# EAGLE design RJ45_EURORACK_BRIDGE_castellated (EAGLE 9.6.2)
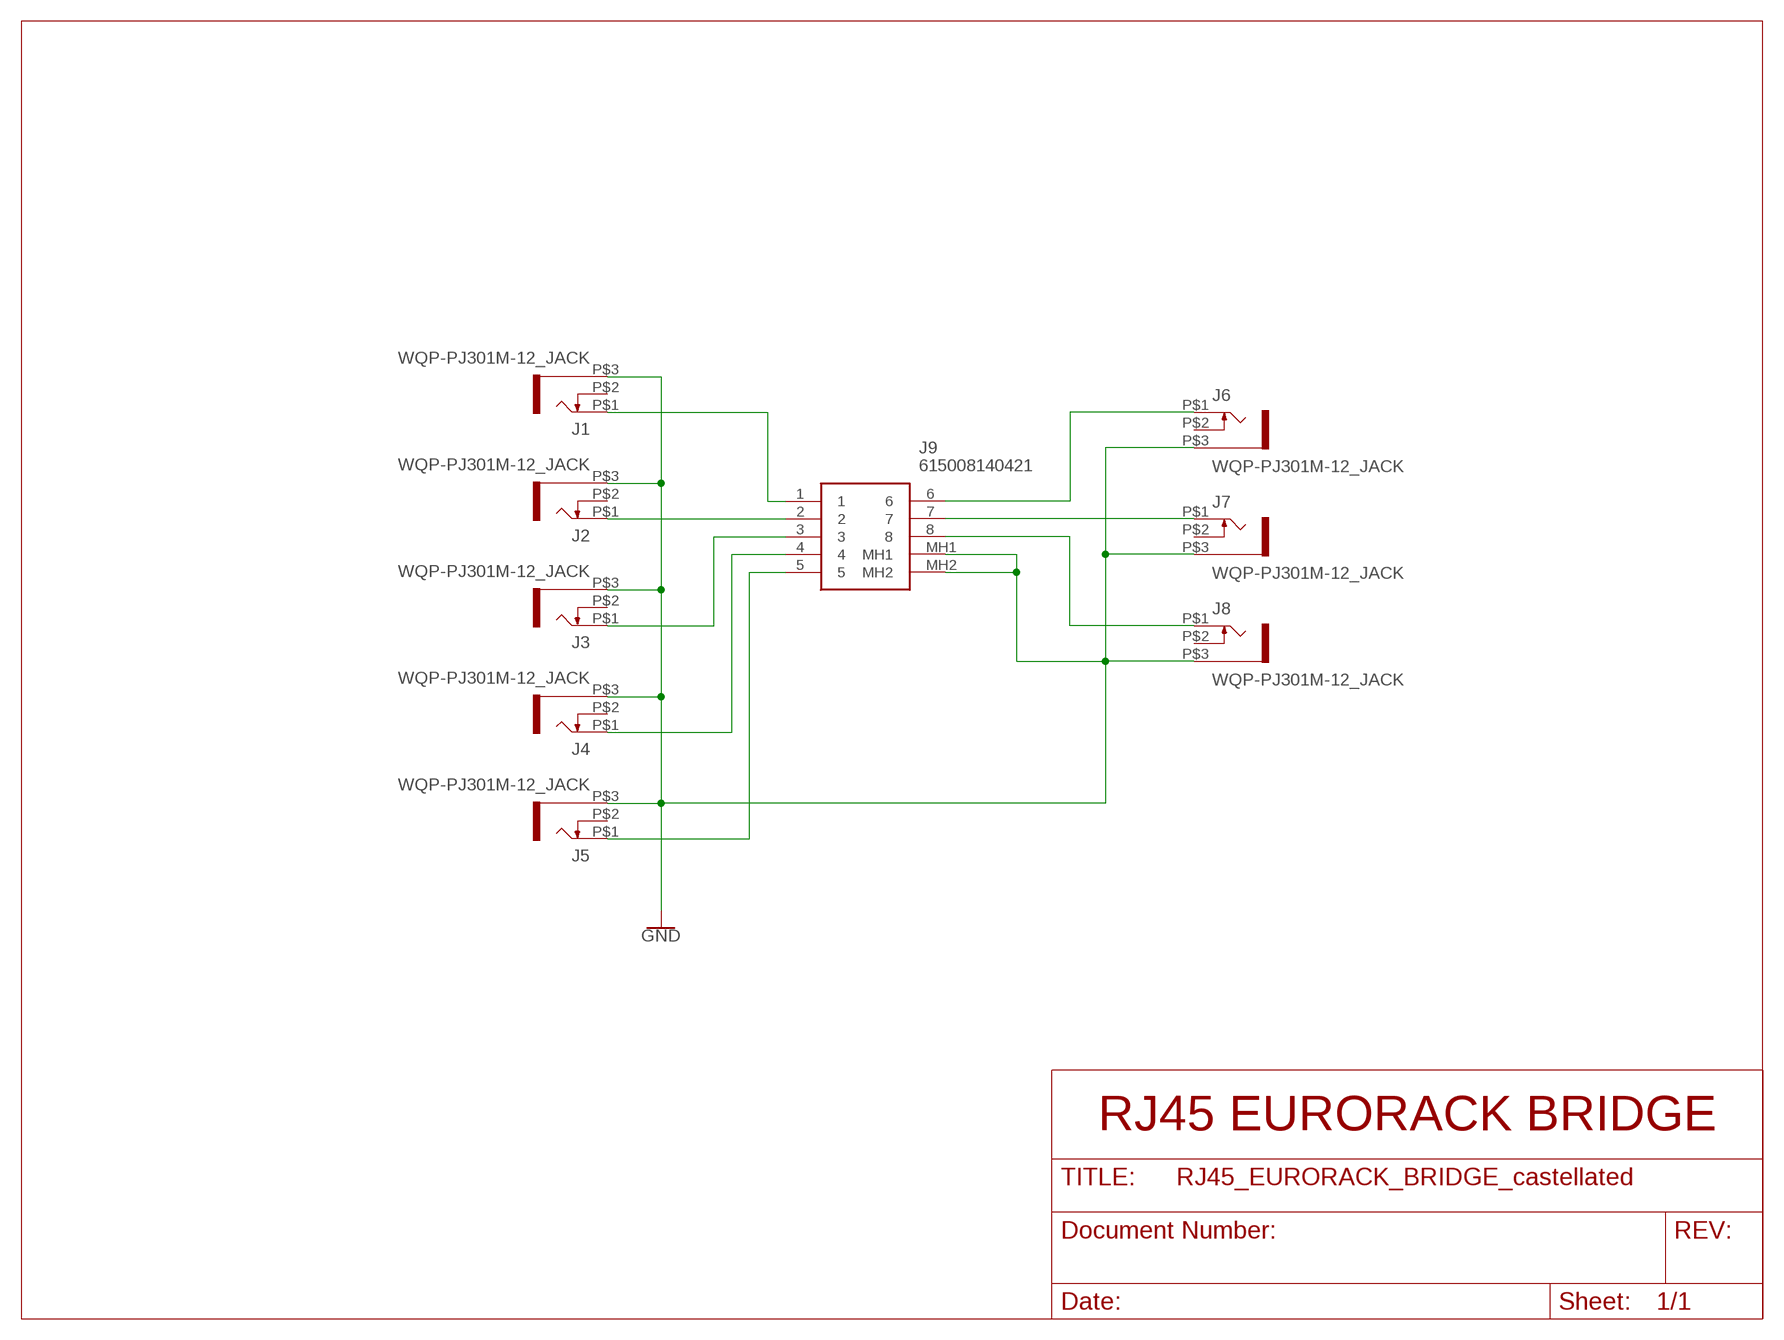
[diagram p0: schematic, sheet 1]

## Parts
J1  WQP-PJ301M-12_JACK  [WQP-PJ301M-12_JACK]
J2  WQP-PJ301M-12_JACK  [WQP-PJ301M-12_JACK]
J3  WQP-PJ301M-12_JACK  [WQP-PJ301M-12_JACK]
J4  WQP-PJ301M-12_JACK  [WQP-PJ301M-12_JACK]
J5  WQP-PJ301M-12_JACK  [WQP-PJ301M-12_JACK]
J6  WQP-PJ301M-12_JACK  [WQP-PJ301M-12_JACK]
J7  WQP-PJ301M-12_JACK  [WQP-PJ301M-12_JACK]
J8  WQP-PJ301M-12_JACK  [WQP-PJ301M-12_JACK]
J9  615008140421  [615008140421]

## Nets
GND: J1.P$3 J2.P$3 J3.P$3 J4.P$3 J5.P$3 J6.P$3 J7.P$3 J8.P$3 J9.MH1 J9.MH2
N$1: J2.P$1 J9.2
N$2: J6.P$1 J9.6
N$3: J7.P$1 J9.7
N$4: J8.P$1 J9.8
N$5: J1.P$1 J9.1
N$6: J3.P$1 J9.3
N$7: J4.P$1 J9.4
N$8: J5.P$1 J9.5
Unconnected: J1.P$2 J2.P$2 J3.P$2 J4.P$2 J5.P$2 J6.P$2 J7.P$2 J8.P$2

## Notes on the sheet
- RJ45 EURORACK BRIDGE

## Library data of the parts
J1-J8 = thonkiconn:WQP-PJ301M-12_JACK
J9 = SamacSys_Parts:615008140421: Wurth Elektronik, Female RJ45 Connector Source: Datasheet <https://katalog.we-online.com/em/datasheet/615008140421.pdf>; DESCRIPTION: Wurth Elektronik, Female RJ45 Connector; HEIGHT: 16.85mm; MANUFACTURER_NAME: Wurth Elektronik; MANUFACTURER_PART_NUMBER: 615008140421; MOUSER_PART_NUMBER: 710-615008140421; MOUSER_PRICE-STOCK: https://www.mouser.co.uk/ProductDetail/Wurth-Elektronik/615008140421?qs=rS3zZhy2AQPMwEyUXKrh9g%3D%3D

## Board
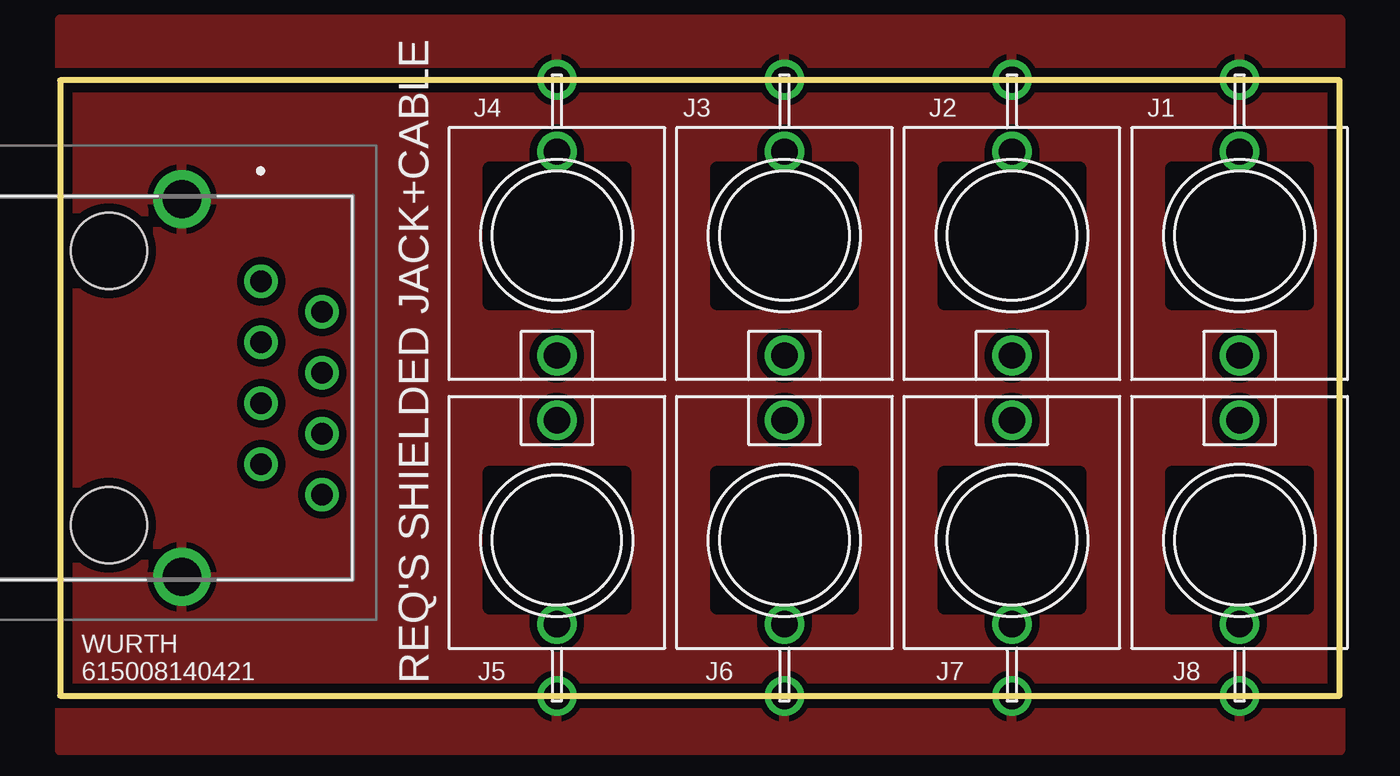
[diagram p1: board, top side]
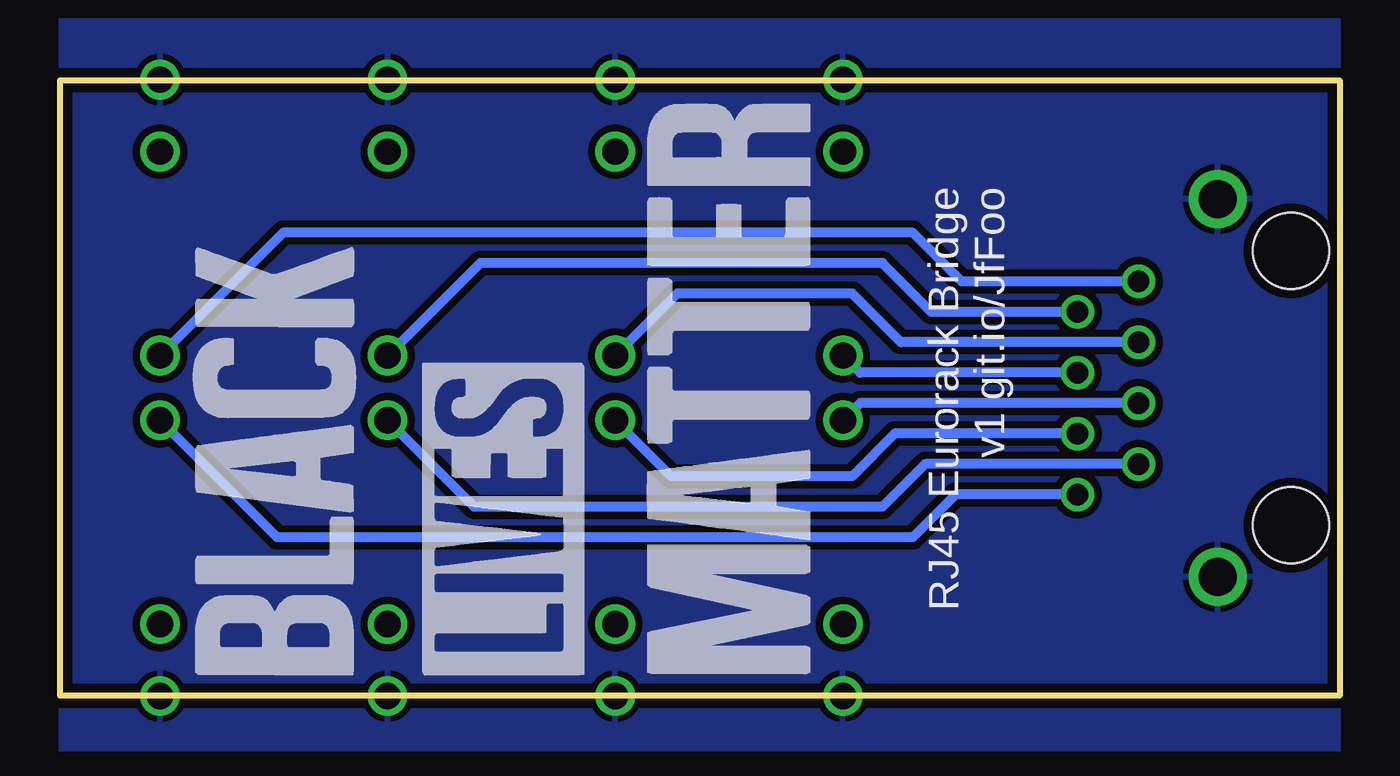
[diagram p2: board, bottom side, seen from below]

Size 53.32 x 25.65 mm. Coordinates in mm from the lower left corner, seen from the top.
Outline: 0,0 53.32,0 53.32,25.65 0,25.65 0,0
Copper layers (1*16): Top 0.0356mm / dielectric 1.5011mm / Bottom 0.0356mm
Design rules "oshpark-2layer": minimum track width 6mil, minimum drill 13mil, track to track 6mil, track to pad 6mil, pad to pad 6mil, via to via 6mil, smd to smd 6mil, copper to edge 15mil, drill to drill 6mil, minimum pad ring 7mil, minimum via ring 7mil, stop-mask expansion 2.5mil, vias tented up to drill 0mil, thermal gap 10mil

### Footprints (pad centres in the part's own frame; a part is rotated, then mirrored left to right if it is on the bottom)
WQP-PJ301M-12_JACK = drill 1.1: P$1 0,5; P$2 0,-3.5; P$3 0,-6.5
615008140421 = drill 0.9 pad 1.4: 1 0,0; 2 1.27,2.54; 3 2.54,0; 4 3.81,2.54; 5 5.08,0; 6 6.35,2.54; 7 7.62,0; 8 8.89,2.54 | drill 1.6 pad 2.4: MH1 -3.43,-3.3; MH2 12.32,-3.3 | hole 3.17: -1.27,-6.35; 10.16,-6.35

### Placement (x,y rotation side)
J1  49.15,19.18 180 top
J2  39.67,19.18 180 top
J3  30.18,19.18 180 top
J4  20.7,19.18 180 top
J5  20.7,6.48 0 top
J6  30.18,6.48 0 top
J7  39.67,6.48 0 top
J8  49.15,6.48 0 top
J9  8.38,17.27 270 top

### Tracks (layer width: path | path; a pad name or v marks a point on that pad's centre or on a via)
GND
  pour Top (isolate 0.305, rank 2): 0,28.19 53.34,28.19 53.34,-2.29 0,-2.29
  pour Bottom (isolate 0.305, rank 3): 53.34,28.19 0,28.19 0,-2.29 53.34,-2.29
N$1
  Bottom 0.406: J9.2 17.02,16 19.05,18.03 35.81,18.03 J2.P$1
N$2
  Bottom 0.406: J9.6 18.54,10.92 20.32,9.14 27.85,9.14 J6.P$1
N$3
  Bottom 0.406: J9.7 17.27,9.65 19.05,7.87 36.06,7.87 J7.P$1
N$4
  Bottom 0.406: J9.8 16,8.38 17.78,6.6 44.28,6.6 J8.P$1
N$5
  Bottom 0.406: J9.1 15.75,17.27 17.78,19.3 44.02,19.3 J1.P$1
N$6
  Bottom 0.406: J9.3 18.29,14.73 20.32,16.76 27.6,16.76 J3.P$1
N$7
  Bottom 0.406: J9.4 19.99,13.46 J4.P$1
N$8
  Bottom 0.406: J9.5 19.99,12.19 J5.P$1

### Text on the board
tPlace: WURTH / 615008140421 | REQ'S SHIELDED JACK+CABLE
bPlace: RJ45 Eurorack Bridge / v1 git.io/JfFoo